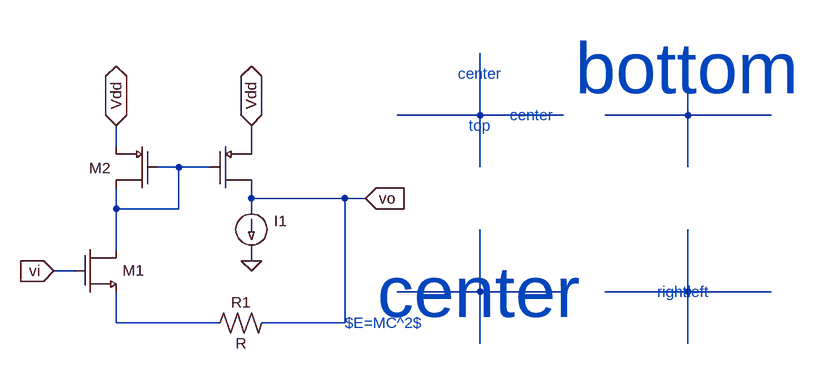
[diagram p0: schematic textAndLabels.asc]
textAndLabels.asc, the LTspice schematic file:
Version 4
SHEET 1 1120 680
WIRE -448 80 -448 -16
WIRE -448 80 -576 80
WIRE -320 80 -448 80
WIRE -128 80 -128 -16
WIRE -128 80 -256 80
WIRE 0 80 -128 80
WIRE -1008 128 -1008 96
WIRE -800 128 -800 96
WIRE -912 160 -944 160
WIRE -864 160 -912 160
WIRE -448 160 -448 80
WIRE -128 160 -128 80
WIRE -800 208 -800 192
WIRE -656 208 -800 208
WIRE -624 208 -656 208
WIRE -1008 224 -1008 192
WIRE -912 224 -912 160
WIRE -912 224 -1008 224
WIRE -800 224 -800 208
WIRE -1008 288 -1008 224
WIRE -800 304 -800 288
WIRE -1072 320 -1104 320
WIRE -448 352 -448 256
WIRE -448 352 -576 352
WIRE -320 352 -448 352
WIRE -128 352 -128 256
WIRE -128 352 -256 352
WIRE 0 352 -128 352
WIRE -1008 400 -1008 352
WIRE -848 400 -1008 400
WIRE -656 400 -656 208
WIRE -656 400 -784 400
WIRE -448 432 -448 352
WIRE -128 432 -128 352
FLAG -800 96 Vdd
IOPIN -800 96 BiDir
FLAG -1008 96 Vdd
IOPIN -1008 96 BiDir
FLAG -800 304 0
FLAG -624 208 vo
IOPIN -624 208 In
FLAG -1104 320 vi
IOPIN -1104 320 In
SYMBOL svg_pmos -864 112 R0
WINDOW 0 70 47 Invisible 2
SYMATTR InstName M3
SYMBOL svg/svg_nmos -1072 272 R0
WINDOW 0 74 47 Left 2
SYMATTR InstName M1
SYMBOL svg_pmos -944 112 M0
WINDOW 0 72 49 Left 2
SYMATTR InstName M2
SYMBOL svg/svg_current -800 224 R0
WINDOW 0 35 19 Left 2
WINDOW 3 36 46 Left 2
SYMATTR InstName I1
SYMATTR Value ""
SYMBOL svg\\svg_res -784 384 R90
WINDOW 0 0 32 VBottom 2
WINDOW 3 32 32 VTop 2
SYMATTR InstName R1
TEXT -656 400 Left 2 ;$E=MC^2$
TEXT -448 80 Top 2 ;top
TEXT -128 80 Bottom 7 ;bottom
TEXT -128 352 Right 2 ;right
TEXT -448 352 Center 7 ;center
TEXT -128 352 Left 2 ;left
TEXT -368 80 Center 2 ;center
TEXT -448 16 Center 2 ;center

The netlist it stands for:
* textAndLabels.asc
M3 vo N003 Vdd Vdd pmodel W=1E7 L=1E8
M1 N003 vi N006 N006 nmodel W=1E7 L=1E8
M2 N003 N003 Vdd Vdd pmodel W=1E7 L=1E8
I1 vo 0
R1 vo N006 R
.model NMOS NMOS
.model PMOS PMOS
.lib standard.mos
* $E=MC^2$
* top
* bottom
* right
* center
* left
* center
* center
.backanno
.end